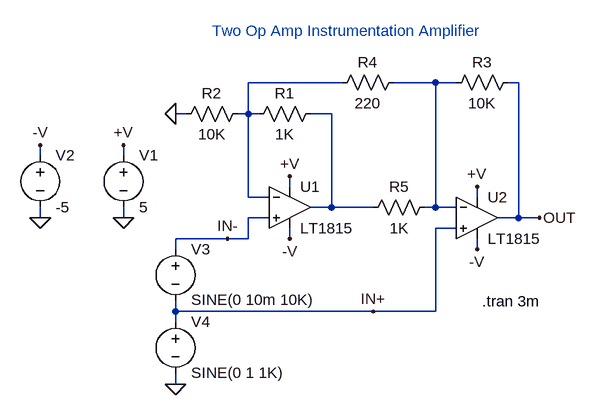
[diagram p0: schematic 1815.asc]
1815.asc, the LTspice schematic file:
Version 4
SHEET 1 896 680
WIRE 272 48 128 48
WIRE 416 48 352 48
WIRE 448 48 416 48
WIRE 544 48 528 48
WIRE 32 96 16 96
WIRE 128 96 128 48
WIRE 128 96 112 96
WIRE 144 96 128 96
WIRE 256 96 224 96
WIRE -192 160 -192 144
WIRE -64 160 -64 144
WIRE 192 208 192 192
WIRE 128 224 128 96
WIRE 160 224 128 224
WIRE 480 224 480 208
WIRE 256 240 256 96
WIRE 256 240 224 240
WIRE 320 240 256 240
WIRE 416 240 416 48
WIRE 416 240 400 240
WIRE 448 240 416 240
WIRE -192 256 -192 240
WIRE -64 256 -64 240
WIRE 160 256 128 256
WIRE 544 256 544 48
WIRE 544 256 512 256
WIRE 576 256 544 256
WIRE 448 272 416 272
WIRE 96 288 16 288
WIRE 128 288 128 256
WIRE 128 288 96 288
WIRE 192 288 192 272
WIRE 16 304 16 288
WIRE 480 304 480 288
WIRE 16 400 16 384
WIRE 320 400 16 400
WIRE 416 400 416 272
WIRE 416 400 320 400
WIRE 16 416 16 400
WIRE 16 512 16 496
FLAG -64 256 0
FLAG 192 192 +V
FLAG -64 144 +V
FLAG 192 288 -V
FLAG -192 256 0
FLAG -192 144 -V
FLAG 16 96 0
FLAG 480 208 +V
FLAG 480 304 -V
FLAG 16 512 0
FLAG 576 256 OUT
FLAG 96 288 IN-
FLAG 320 400 IN+
SYMBOL voltage -64 144 R0
SYMATTR InstName V1
SYMATTR Value 5
SYMBOL voltage -192 144 R0
SYMATTR InstName V2
SYMATTR Value -5
SYMBOL res 240 80 R90
WINDOW 0 0 56 VBottom 2
WINDOW 3 32 56 VTop 2
SYMATTR InstName R1
SYMATTR Value 1K
SYMBOL res 128 80 R90
WINDOW 0 0 56 VBottom 2
WINDOW 3 32 56 VTop 2
SYMATTR InstName R2
SYMATTR Value 10K
SYMBOL opamps\\LT1815 192 240 R0
SYMATTR InstName U1
SYMBOL res 544 32 R90
WINDOW 0 0 56 VBottom 2
WINDOW 3 32 56 VTop 2
SYMATTR InstName R3
SYMATTR Value 10K
SYMBOL res 368 32 R90
WINDOW 0 0 56 VBottom 2
WINDOW 3 32 56 VTop 2
SYMATTR InstName R4
SYMATTR Value 220
SYMBOL opamps\\LT1815 480 256 R0
SYMATTR InstName U2
SYMBOL res 416 224 R90
WINDOW 0 0 56 VBottom 2
WINDOW 3 32 56 VTop 2
SYMATTR InstName R5
SYMATTR Value 1K
SYMBOL voltage 16 288 R0
WINDOW 3 24 94 Left 2
SYMATTR Value SINE(0 10m 10K)
SYMATTR InstName V3
SYMBOL voltage 16 400 R0
WINDOW 3 24 94 Left 2
SYMATTR Value SINE(0 1 1K)
SYMATTR InstName V4
TEXT 488 384 Left 2 !.tran 3m
TEXT 280 -16 Bottom 2 ;Two Op Amp Instrumentation Amplifier

The netlist it stands for:
* 1815.asc
V1 +V 0 5
V2 -V 0 -5
R1 N003 N001 1K
R2 N001 0 10K
* U1: LT1815 (symbol opamps\LT1815 not available, pins judged from their places): In+=IN- In-=N001 V+=+V V-=-V OUT=N003
R3 OUT N002 10K
R4 N002 N001 220
* U2: LT1815 (symbol opamps\LT1815 not available, pins judged from their places): In+=IN+ In-=N002 V+=+V V-=-V OUT=OUT
R5 N002 N003 1K
V3 IN- IN+ SINE(0 10m 10K)
V4 IN+ 0 SINE(0 1 1K)
.tran 3m
* Two Op Amp Instrumentation Amplifier
.backanno
.end